# EAGLE schematic Fan (EAGLE 6.3)
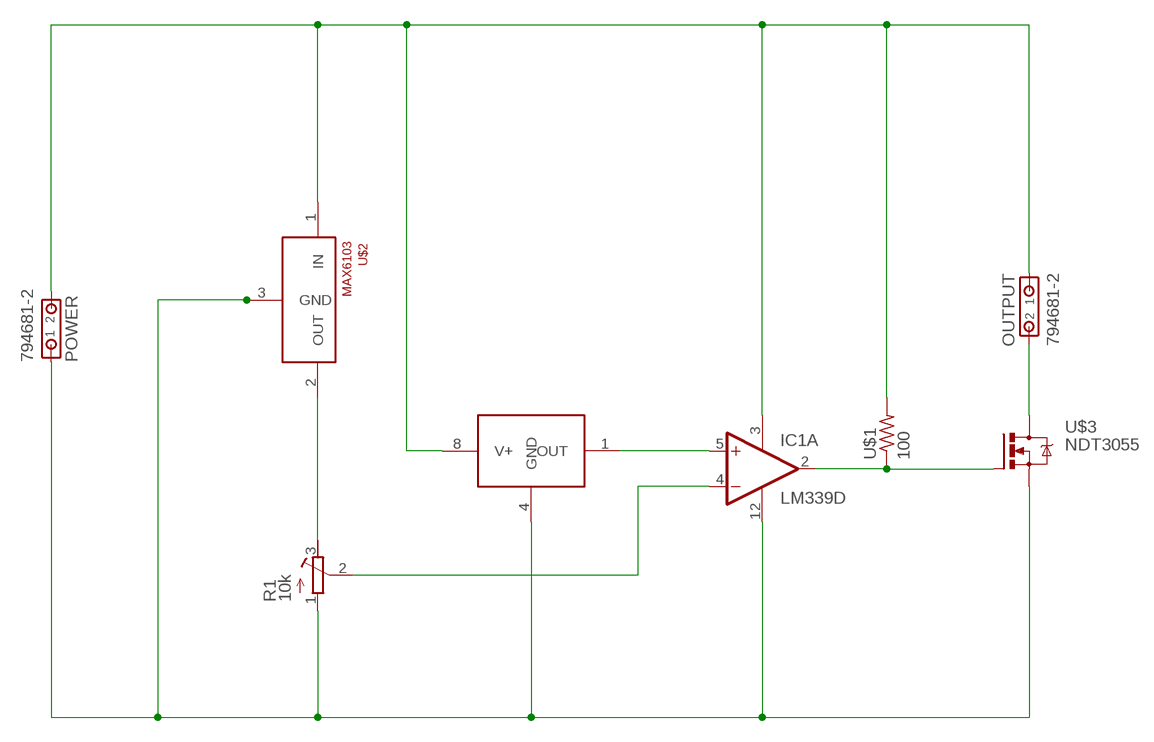
[diagram p0: schematic, sheet 1]

## Parts
IC1  LM339D  [SO14]
OUTPUT  794681-2  [794681-2]
POWER  794681-2  [794681-2]
R1  10k  R-TRIMMTS63Y  [RTRIMTS63Y]
U$1  100  RESISTORSMD1206  [R1206]
U$2  MAX6103  [SOT23]
U$3  NDT3055  N-CHANNEL_MOSFETNDT3055"  [SOT223]
U$4  LM35  [SO-08]

## Nets
12V: IC1.3(P:V+) OUTPUT.1 POWER.2 U$1.2 U$2.1(IN) U$4.8(V+)
GND: IC1.12(P:GND) POWER.1 R1.1(E) U$2.3(GND) U$3.3(S) U$4.4(GND)
N$1: IC1.2(A:OUT) U$1.1 U$3.1(G)
N$3: IC1.4(A:-IN) R1.2(S)
N$4: R1.3(A) U$2.2(OUT)
N$5: OUTPUT.2 U$3.2(D) U$3.4(D)
N$8: IC1.5(A:+IN) U$4.1(OUT)
Unconnected: IC1.1(B:OUT) IC1.6(B:-IN) IC1.7(B:+IN) IC1.8(C:-IN) IC1.9(C:+IN) IC1.10(D:-IN) IC1.11(D:+IN) IC1.13(D:OUT) IC1.14(C:OUT)

## Library data of the parts
IC1 = linear:LM339: Low Power Low Offset Voltage Quad Comparators with open collector; LM139/LM239/LM339/LM2901/LM3302
OUTPUT POWER = con-amp:794681-2: Micro MATE-N-LOK Connectors grid 1.5mm Dual Row Through Hole Vertical Metal Through Hole Holddowns Source: ENG_CD_794681_E.pdf
R1 = resistor:R-TRIMM: Trimm resistor
U$1 = SolarJacketsADC:RESISTOR
U$2 = SolarJacketsADC:MAX6103
U$3 = SolarJacketsADC:N-CHANNEL_MOSFET; PART_NUM: NDT3055
U$4 = SolarJacketsADC:LM35